# Altium schematic sheet tester.SchDoc
size A0
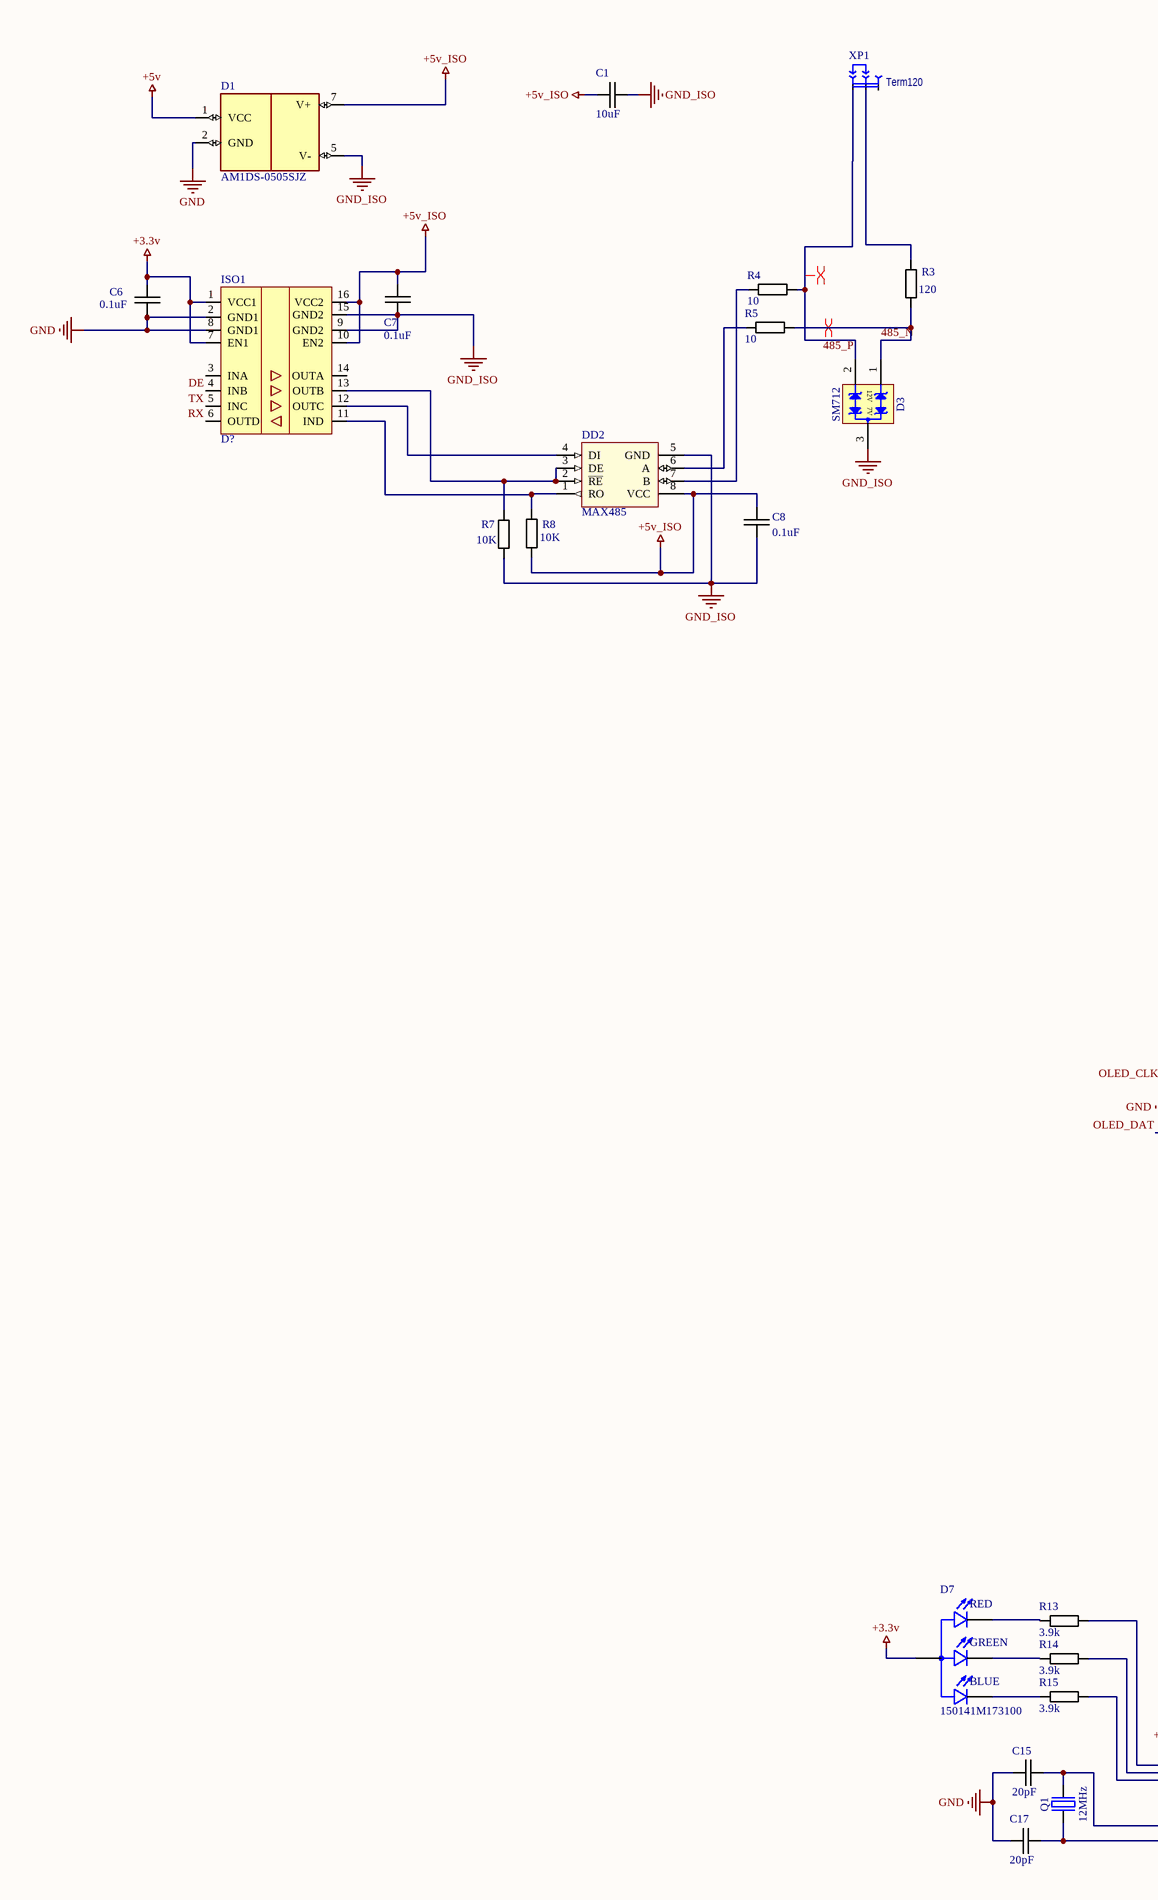
[diagram p0: tester.SchDoc, top left]
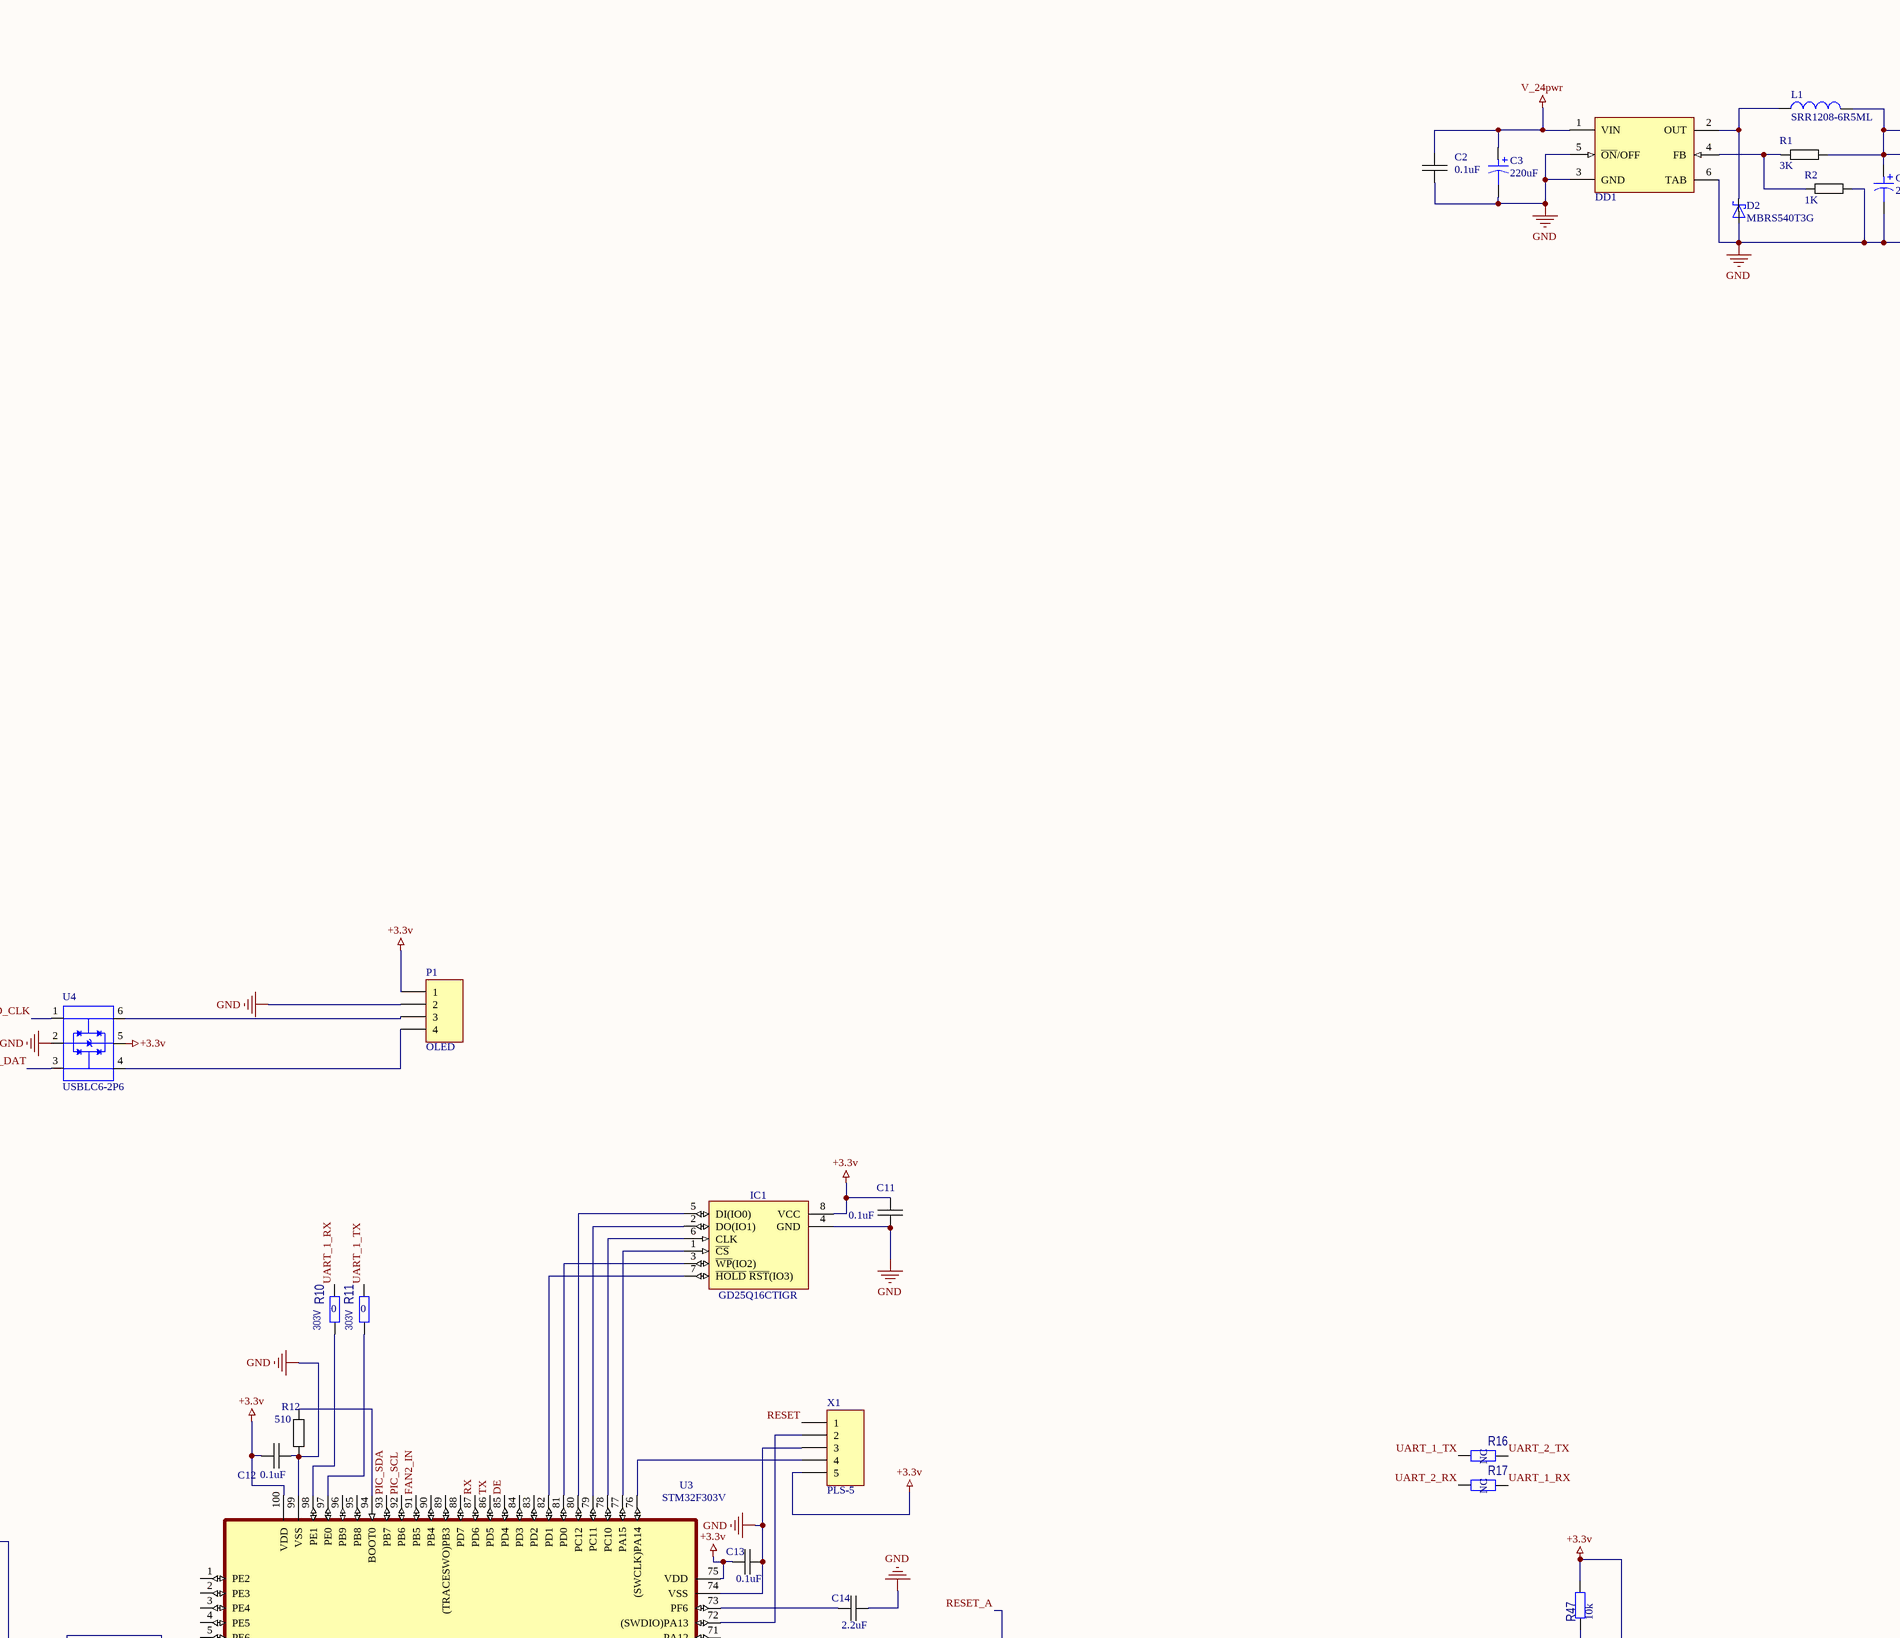
[diagram p1: tester.SchDoc, top middle]
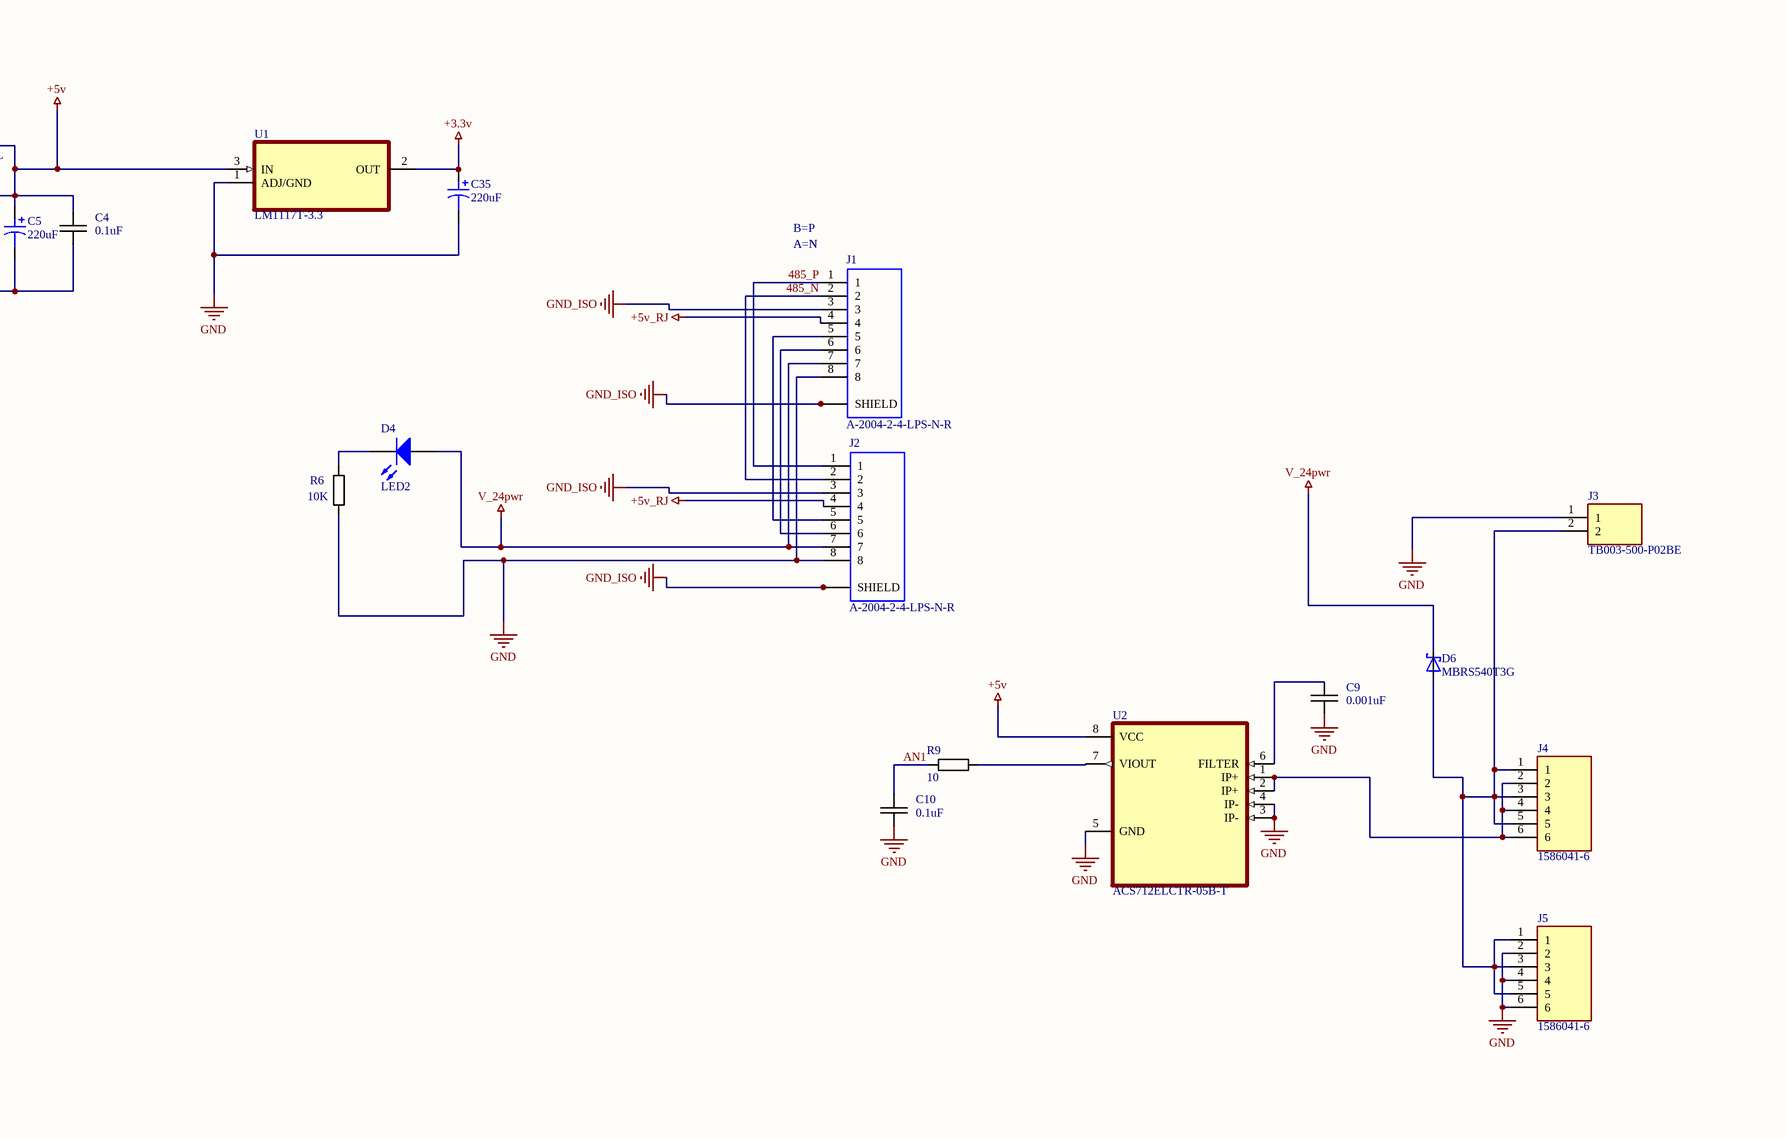
[diagram p2: tester.SchDoc, top right]
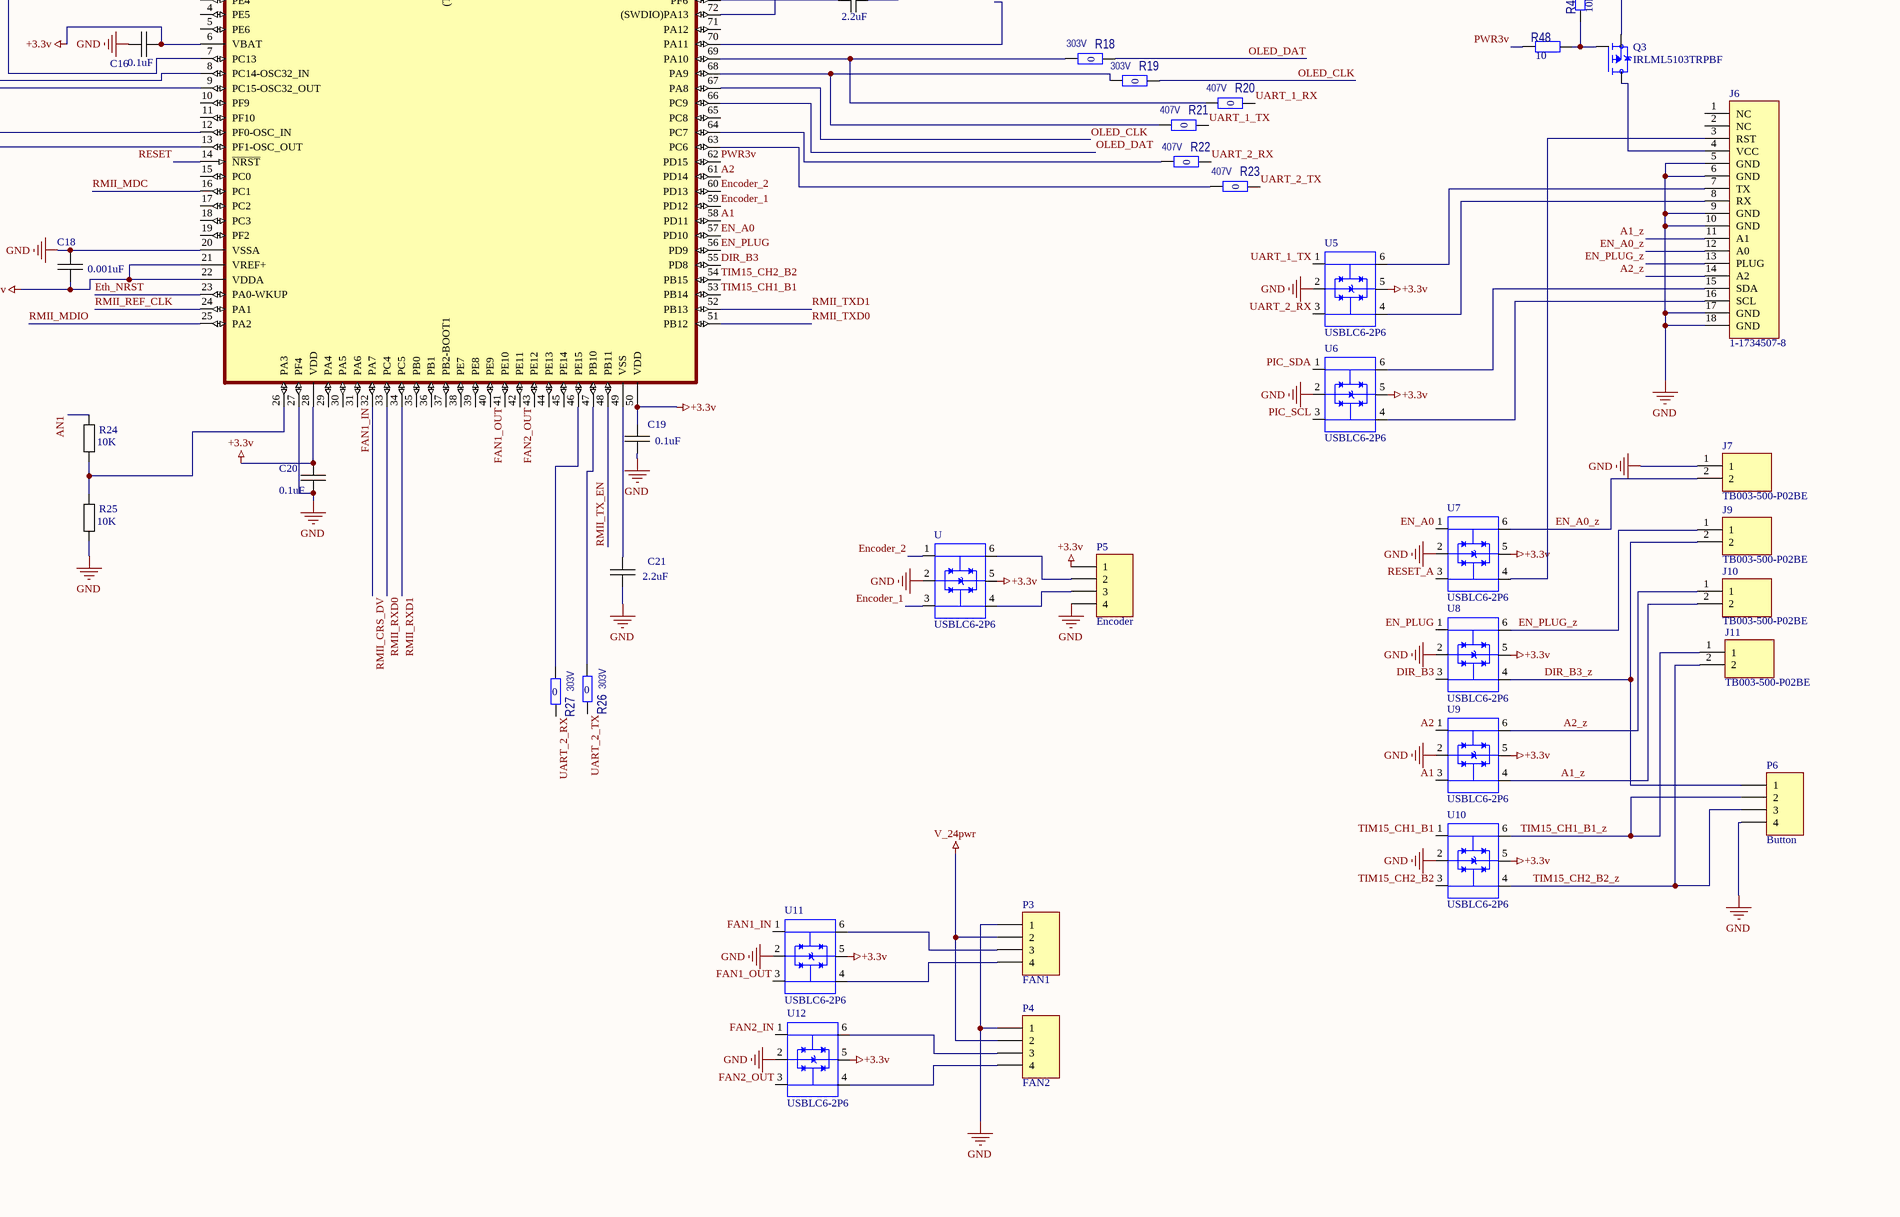
[diagram p3: tester.SchDoc, bottom middle]
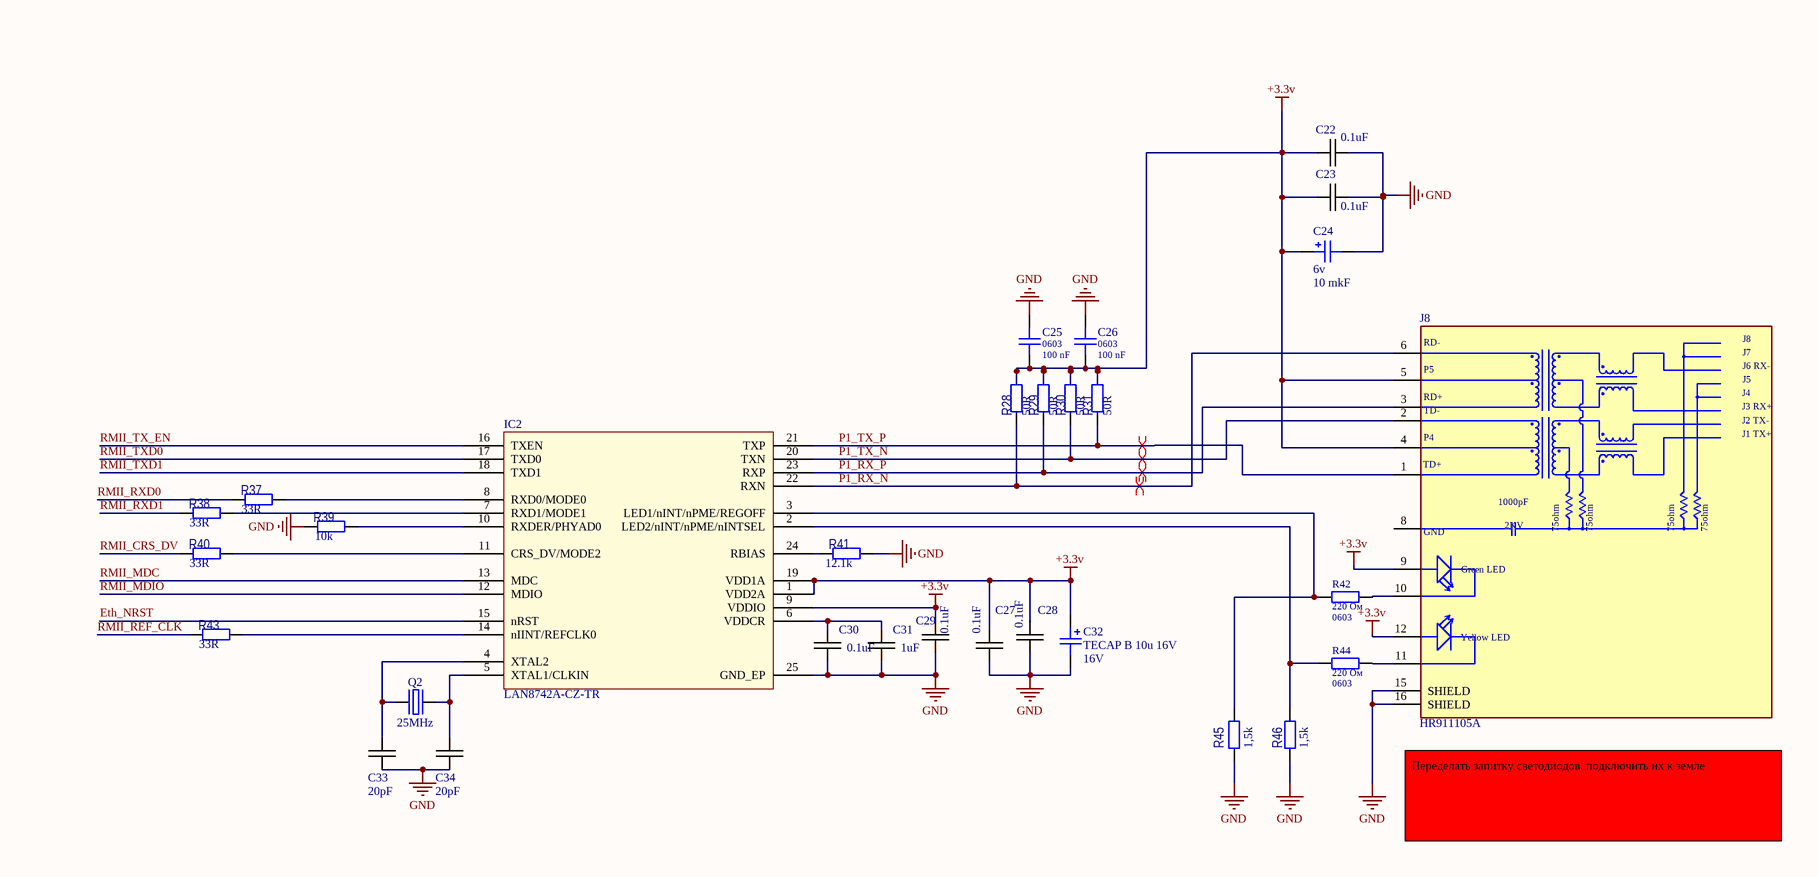
[diagram p4: tester.SchDoc, bottom right]

## Parts
C1  10uF  [CAPC3225X270N]
C2  0.1uF  [CAPACITOR 0603]
C3  value 220uF  [ECR 10x13mm]  (hidden comment: 220uF 50v)
C4  0.1uF  [CAPACITOR 0603]
C5  value 220uF  [ECR 10x13mm]  (hidden comment: 220uF 50v)
C6  0.1uF  [CAPACITOR 0603]
C7  0.1uF  [CAPACITOR 0603]
C8  0.1uF  [CAPACITOR 0603]
C9  0.001uF  [CAPACITOR 0603]
C10  0.1uF  [CAPACITOR 0603]
C11  0.1uF  [CAPACITOR 0603]
C12  0.1uF  [CAPACITOR 0603]
C13  0.1uF  [CAPACITOR 0603]
C14  2.2uF  [CAPACITOR 0805]
C15  20pF  [CAPACITOR 0603]
C16  0.1uF  [CAPACITOR 0603]
C17  20pF  [CAPACITOR 0603]
C18  0.001uF  [CAPACITOR 0603]
C19  0.1uF  [CAPACITOR 0603]
C20  0.1uF  [CAPACITOR 0603]
C21  2.2uF  [CAPACITOR 0805]
C22  0.1uF  [CAPACITOR 0603]
C23  0.1uF  [CAPACITOR 0603]
C24  value 10 mkF  Voltage: 6v  [TECAP B]  (hidden comment: Cap T)
C25  Type: 0603  [CAPCHIP0603]  (hidden comment: 100 nF)
C26  Type: 0603  [CAPCHIP0603]  (hidden comment: 100 nF)
C27  0.1uF  [CAPACITOR 0603]
C28  0.1uF  [CAPACITOR 0603]
C29  0.1uF  [CAPACITOR 0603]
C30  0.1uF  [CAPACITOR 0603]
C31  1uF  [CAPACITOR 0603]
C32  Voltage: 16V  [TECAP B]  (hidden comment: TECAP B 10u 16V)
C33  20pF  [CAPACITOR 0603]
C34  20pF  [CAPACITOR 0603]
C35  value 220uF  [ECR 10x13mm]  (hidden comment: 220uF 50v)
D1  AM1DS-0505SJZ  [AM2D-NZ]
D2  MBRS540T3G  [DIOM7958X213N]
D3  SM712  [SOT23]
D4  LED2  [3.2X1.6X1.1]
D6  MBRS540T3G  [DIOM7958X213N]
D7  150141M173100  [LED_150141M173100]
DD1  LM2596S-ADJ  [TO-263]  (value not drawn)
DD2  MAX485  [NSO8]
IC1  GD25Q16CTIGR  [NSO8]
IC2  LAN8742A-CZ-TR  [LAN8742A]
ISO1  D?  [*SOIC127P1030X265-16N]
J1  A-2004-2-4-LPS-N-R  [ASSMANN_A-2004-2-4-LPS-N-R]
J2  A-2004-2-4-LPS-N-R  [ASSMANN_A-2004-2-4-LPS-N-R]
J3  TB003-500-P02BE  [CUI_TB003-500-P02BE]
J4  1586041-6  [TE_1586041-6]
J5  1586041-6  [TE_1586041-6]
J6  1-1734507-8  [TE_1-1734507-8]
J7  TB003-500-P02BE  [CUI_TB003-500-P02BE]
J8  HR911105A  [HANRUN_HR911105A]
J9  TB003-500-P02BE  [CUI_TB003-500-P02BE]
J10  TB003-500-P02BE  [CUI_TB003-500-P02BE]
J11  TB003-500-P02BE  [CUI_TB003-500-P02BE]
L1  SRR1208-6R5ML  [SRR1208]
P1  OLED  [HDR1X4]
P3  FAN1  [HDR1X4]
P4  FAN2  [HDR1X4]
P5  Encoder  [HDR1X4]
P6  Button  [HDR1X4]
Q1  12MHz  [HC49SM]
Q2  25MHz  [HC49SM]
Q3  IRLML5103TRPBF  [SOT95P237X112-3N]
R1  3K  [Resistor 0603]
R2  1K  [Resistor 0603]
R3  120  [Resistor 0805]
R4  10  [Resistor 0805]
R5  10  [Resistor 0805]
R6  10K  [Resistor 0805]
R7  10K  [Resistor 0805]
R8  10K  [Resistor 0805]
R9  10  [Resistor 0805]
R10  0  [RESCHIP0603]
R11  0  [RESCHIP0603]
R12  510  [Resistor 0805]
R13  3.9k  [Resistor 0805]
R14  3.9k  [Resistor 0805]
R15  3.9k  [Resistor 0805]
R16  NC  [RESCHIP0603]
R17  NC  [RESCHIP0603]
R18  0  [RESCHIP0603]
R19  0  [RESCHIP0603]
R20  0  Class: 407V  [RESCHIP0603]
R21  0  Class: 407V  [RESCHIP0603]
R22  0  Class: 407V  [RESCHIP0603]
R23  0  Class: 407V  [RESCHIP0603]
R24  10K  [Resistor 0805]
R25  10K  [Resistor 0805]
R26  0  [RESCHIP0603]
R27  0  [RESCHIP0603]
R28  50R  [RESCHIP0603]
R29  50R  [RESCHIP0603]
R30  50R  [RESCHIP0603]
R31  50R  [RESCHIP0603]
R37  33R  [RESCHIP0603]
R38  33R  [RESCHIP0603]
R39  10k  [RESCHIP0603]
R40  33R  [RESCHIP0603]
R41  12.1k  [RESCHIP0603]
R42  Type: 0603  [RESCHIP0603]  (hidden comment: 220 Ом)
R43  33R  [RESCHIP0603]
R44  Type: 0603  [RESCHIP0603]  (hidden comment: 220 Ом)
R45  1,5k  [RESCHIP0603]
R46  1,5k  [RESCHIP0603]
R47  10k  [RESCHIP0805]
R48  10  [RESCHIP0805]
U  USBLC6-2P6  [SOT50P160X60-6N]
U1  LM1117T-3.3  [TO-220-KCS0003B]
U2  ACS712ELCTR-05B-T  [SOIC127P600X175-8N]
U3  STM32F303V  [QFP50P1600X1600X160-100N]
U4  USBLC6-2P6  [SOT50P160X60-6N]
U5  USBLC6-2P6  [SOT50P160X60-6N]
U6  USBLC6-2P6  [SOT50P160X60-6N]
U7  USBLC6-2P6  [SOT50P160X60-6N]
U8  USBLC6-2P6  [SOT50P160X60-6N]
U9  USBLC6-2P6  [SOT50P160X60-6N]
U10  USBLC6-2P6  [SOT50P160X60-6N]
U11  USBLC6-2P6  [SOT50P160X60-6N]
U12  USBLC6-2P6  [SOT50P160X60-6N]
X1  PLS-5  [PLS-5-3D]
XP1  Term120  [ZL201-3]

## Nets
3.3v: C18.2 U3.21(VREF+) U3.22(VDDA)
+3.3v: C6.1 C11.1 C12.1 C13.1 C16.2 C19.1 C20.1 C22.1 C23.1 C24.1 C25.1 C26.1 C27.1 C28.2 C29.1 C32.1 C35.1 D7.1(A) IC1.8(VCC) IC2.1(VDD2A) IC2.9(VDDIO) IC2.19(VDD1A) ISO1.1(VCC1) ISO1.7(EN1) J8.4(P4) J8.5(P5) J8.9(GA) J8.12(YA) P1.1 P5.1 Q3.2(S) R28.2 R29.2 R30.2 R31.2 R47.2 U.5(VBUS) U1.2(OUT) U3.6(VBAT) U3.28(VDD) U3.50(VDD) U3.75(VDD) U3.100(VDD) U4.5(VBUS) U5.5(VBUS) U6.5(VBUS) U7.5(VBUS) U8.5(VBUS) U9.5(VBUS) U10.5(VBUS) U11.5(VBUS) U12.5(VBUS) X1.5
+5v: C4.2 C5.1 D1.1(VCC) L1.P$2 R1.2 U1.3(IN) U2.8(VCC)
+5v_ISO: C1.2 C7.2 C8.2 D1.7(V+) DD2.8(VCC) ISO1.10(EN2) ISO1.16(VCC2) R8.1
+5v_RJ: J1.4 J2.4
GND: C2.1 C3.2 C4.1 C5.2 C6.2 C9.1 C10.1 C11.2 C12.2 C13.2 C14.2 C15.1 C16.1 C17.1 C18.1 C19.2 C20.2 C21.1 C22.2 C23.2 C24.2 C25.2 C26.2 C27.2 C28.1 C29.2 C30.2 C31.2 C32.2 C33.1 C34.1 C35.2 D1.2(GND) D2.A DD1.3(GND) DD1.5(~{ON}/OFF) DD1.6(TAB) IC1.4(GND) IC2.25(GND_EP) ISO1.2(GND1) ISO1.8(GND1) J1.8 J2.8 J3.1 J5.2 J5.4 J5.6 J6.5(GND) J6.6(GND) J6.9(GND) J6.10(GND) J6.17(GND) J6.18(GND) J7.1 J8.15(SHIELD) J8.16(SHIELD) P1.2 P3.1 P4.1 P5.4 P6.4 R2.2 R6.2 R12.2 R25.1 R39.1 R41.2 R45.1 R46.1 U.2(GND) U1.1(ADJ/GND) U2.3(IP-) U2.4(IP-) U2.5(GND) U3.20(VSSA) U3.27(PF4) U3.74(VSS) U3.99(VSS) U4.2(GND) U5.2(GND) U6.2(GND) U7.2(GND) U8.2(GND) U9.2(GND) U10.2(GND) U11.2(GND) U12.2(GND) X1.3
GND_ISO: C1.1 C7.1 C8.1 D1.5(V-) D3.3(GND) DD2.5(GND) ISO1.9(GND2) ISO1.15(GND2) J1.3 J1.S1(SHIELD) J1.S2(SHIELD) J2.3 J2.S1(SHIELD) J2.S2(SHIELD) R7.2
V_24pwr: C2.2 C3.1 D4.1(A) D6.C DD1.1(VIN) J1.7 J2.7 P3.2 P4.2
485_N: D3.1(I/O1) J1.2 J2.2 R3.2 R5.1
485_P: D3.2(I/O2) J1.1 J2.1 R4.1 XP1.1
A1: U3.58(PD11) U9.3(I/O2_1)
A1_z: J6.11(A1) J10.2 U9.4(I/O2_2)
A2: U3.61(PD14) U9.1(I/O1_1)
A2_z: J6.14(A2) J10.1 U9.6(I/O1_2)
AN1: C10.2 R9.2 R24.2
DE: ISO1.4(INB) U3.85(PD4)
DIR_B3: U3.55(PD8) U8.3(I/O2_1)
DIR_B3_z: J9.2 P6.1 U8.4(I/O2_2)
EN_A0: U3.57(PD10) U7.1(I/O1_1)
EN_A0_z: J6.12(A0) J7.2 U7.6(I/O1_2)
EN_PLUG: U3.56(PD9) U8.1(I/O1_1)
EN_PLUG_z: J6.13(PLUG) J9.1 U8.6(I/O1_2)
Encoder_1: U.3(I/O2_1) U3.59(PD12)
Encoder_2: U.1(I/O1_1) U3.60(PD13)
Eth_NRST: IC2.15(nRST) U3.23(PA0-WKUP)
FAN1_IN: U3.31(PA6) U11.1(I/O1_1)
FAN1_OUT: U3.40(PE9) U11.3(I/O2_1)
FAN2_IN: U3.91(PB5) U12.1(I/O1_1)
FAN2_OUT: U3.42(PE11) U12.3(I/O2_1)
OLED_CLK: R19.2 U3.67(PA8) U4.1(I/O1_1)
OLED_DAT: R18.2 U3.66(PC9) U4.3(I/O2_1)
P1_RX_N: IC2.22(RXN) J8.6(RD-) R28.1
P1_RX_P: IC2.23(RXP) J8.3(RD+) R29.1
P1_TX_N: IC2.20(TXN) J8.2(TD-) R30.1
P1_TX_P: IC2.21(TXP) J8.1(TD+) R31.1
PIC_SCL: U3.92(PB6) U6.3(I/O2_1)
PIC_SDA: U3.93(PB7) U6.1(I/O1_1)
PWR3v: R48.1 U3.62(PD15)
RESET: U3.14(~{NRST}) X1.1
RESET_A: U3.70(PA11) U7.3(I/O2_1)
RMII_CRS_DV: R40.1 U3.32(PA7)
RMII_MDC: IC2.13(MDC) U3.16(PC1)
RMII_MDIO: IC2.12(MDIO) U3.25(PA2)
RMII_REF_CLK: R43.1 U3.24(PA1)
RMII_RXD0: R37.1 U3.33(PC4)
RMII_RXD1: R38.1 U3.34(PC5)
RMII_TX_EN: IC2.16(TXEN) U3.48(PB11)
RMII_TXD0: IC2.17(TXD0) U3.51(PB12)
RMII_TXD1: IC2.18(TXD1) U3.52(PB13)
RX: ISO1.6(OUTD) U3.87(PD6)
TIM15_CH1_B1: U3.53(PB14) U10.1(I/O1_1)
TIM15_CH1_B1_z: J11.1 P6.2 U10.6(I/O1_2)
TIM15_CH2_B2: U3.54(PB15) U10.3(I/O2_1)
TIM15_CH2_B2_z: J11.2 P6.3 U10.4(I/O2_2)
TX: ISO1.5(INC) U3.86(PD5)
UART_1_RX: R10.2 R17.2 R20.2
UART_1_TX: R11.2 R16.1 R21.2 U5.1(I/O1_1)
UART_2_RX: R17.1 R22.2 R27.2 U5.3(I/O2_1)
UART_2_TX: R16.2 R23.2 R26.2
NetC9_2: C9.2 U2.6(FILTER)
NetC14_1: C14.1 U3.73(PF6)
NetC15_2: C15.2 Q1.2(OSC2) U3.12(PF0-OSC_IN)
NetC17_2: C17.2 Q1.1(OSC1) U3.13(PF1-OSC_OUT)
NetC21_2: C21.2 U3.49(VSS)
NetC30_1: C30.1 C31.1 IC2.6(VDDCR)
NetC33_2: C33.2 IC2.4(XTAL2) Q2.1(OSC1)
NetC34_2: C34.2 IC2.5(XTAL1/CLKIN) Q2.2(OSC2)
NetD2_C: D2.C DD1.2(OUT) L1.P$1
NetD4_2: D4.2(K) R6.1
NetD6_A: D6.A J3.2 J4.1 J4.3 J4.5 J5.1 J5.3 J5.5
NetD7_2: D7.2(B_C) R15.2
NetD7_3: D7.3(R_C) R13.2
NetD7_4: D7.4(G_C) R14.2
NetDD1_4: DD1.4(FB) R1.1 R2.1
NetDD2_1: DD2.1(RO) ISO1.11(IND) R8.2
NetDD2_2: DD2.2(~{RE}) DD2.3(DE) ISO1.13(OUTB) R7.1
NetDD2_4: DD2.4(DI) ISO1.12(OUTC)
NetDD2_6: DD2.6(A) R5.2
NetDD2_7: DD2.7(B) R4.2
NetIC1_1: IC1.1(~{CS}) U3.77(PA15)
NetIC1_2: IC1.2(DO(IO1)) U3.79(PC11)
NetIC1_3: IC1.3(~{WP}(IO2)) U3.81(PD0)
NetIC1_5: IC1.5(DI(IO0)) U3.80(PC12)
NetIC1_6: IC1.6(CLK) U3.78(PC10)
NetIC1_7: IC1.7(~{HOLD}_~{RST}(IO3)) U3.82(PD1)
NetIC2_2: IC2.2(LED2/nINT/nPME/nINTSEL) R44.1 R46.2
NetIC2_3: IC2.3(LED1/nINT/nPME/REGOFF) R42.1 R45.2
NetIC2_7: IC2.7(RXD1/MODE1) R38.2
NetIC2_8: IC2.8(RXD0/MODE0) R37.2
NetIC2_10: IC2.10(RXDER/PHYAD0) R39.2
NetIC2_11: IC2.11(CRS_DV/MODE2) R40.2
NetIC2_14: IC2.14(nIINT/REFCLK0) R43.2
NetIC2_24: IC2.24(RBIAS) R41.1
NetJ1_5: J1.5 J2.5
NetJ1_6: J1.6 J2.6
NetJ4_2: J4.2 J4.4 J4.6 U2.1(IP+) U2.2(IP+)
NetJ6_3: J6.3(RST) U7.4(I/O2_2)
NetJ6_4: J6.4(VCC) Q3.3(D)
NetJ6_7: J6.7(TX) U5.6(I/O1_2)
NetJ6_8: J6.8(RX) U5.4(I/O2_2)
NetJ6_15: J6.15(SDA) U6.6(I/O1_2)
NetJ6_16: J6.16(SCL) U6.4(I/O2_2)
NetJ8_10: J8.10(GC) R42.2
NetJ8_11: J8.11(YC) R44.2
NetP1_3: P1.3 U4.6(I/O1_2)
NetP1_4: P1.4 U4.4(I/O2_2)
NetP3_3: P3.3 U11.6(I/O1_2)
NetP3_4: P3.4 U11.4(I/O2_2)
NetP4_3: P4.3 U12.6(I/O1_2)
NetP4_4: P4.4 U12.4(I/O2_2)
NetP5_2: P5.2 U.6(I/O1_2)
NetP5_3: P5.3 U.4(I/O2_2)
NetQ3_1: Q3.1(G) R47.1 R48.2
NetR3_1: R3.1 XP1.2
NetR9_1: R9.1 U2.7(VIOUT)
NetR10_1: R10.1 U3.98(PE1)
NetR11_1: R11.1 U3.97(PE0)
NetR12_1: R12.1 U3.94(BOOT0)
NetR13_1: R13.1 U3.7(PC13)
NetR14_1: R14.1 U3.8(PC14-OSC32_IN)
NetR15_1: R15.1 U3.9(PC15-OSC32_OUT)
NetR18_1: R18.1 R20.1 U3.69(PA10)
NetR19_1: R19.1 R21.1 U3.68(PA9)
NetR22_1: R22.1 U3.64(PC7)
NetR23_1: R23.1 U3.63(PC6)
NetR24_1: R24.1 R25.2 U3.26(PA3)
NetR26_1: R26.1 U3.47(PB10)
NetR27_1: R27.1 U3.46(PE15)
NetU3_72: U3.72((SWDIO)PA13) X1.2
NetU3_76: U3.76((SWCLK)PA14) X1.4

Not connected (* = marked no-connect by the designer): ISO1 3(INA) 14(OUTA); J6 1(NC) 2(NC); J8 8(GND); U3 1(PE2) 2(PE3) 3(PE4) 4(PE5) 5(PE6) 10(PF9) 11(PF10) 15(PC0) 17(PC2) 18(PC3) 19(PF2) 29(PA4) 30(PA5) 35(PB0) 36(PB1) 37(PB2-BOOT1) 38(PE7) 39(PE8) 41(PE10) 43(PE12) 44(PE13) 45(PE14) 65(PC8) 71(PA12) 83(PD2) 84(PD3) 88(PD7) 89((TRACESWO)PB3) 90(PB4) 95(PB8) 96(PB9); XP1 3

## Layout directives
differential pair: 485_N, 485_P, P1_RX_N, P1_RX_P, P1_TX_N, P1_TX_P

## Notes on the sheet
- B=P
- (near J1) A=N
- (near J8) Переделать запитку светодиодов. подключить их к земле
- (in symbol 150141M173100) RED; GREEN; BLUE
- (in symbol HR911105A) J7; J6 RX-; J5; J4; J3 RX+; J2 TX-; J1 TX+; 1000pF; 2KV; 75ohm; Green LED; Yellow LED
- (in symbol SM712) 12V; 7V

## Library data of the parts
C1 C2 C4 C6-C23 C27-C31 C33 C34 = Capasitor: Value: *
C3 C5 C35 = Cap Pol: Polarized Capacitor (Rad); Voltage: 50; Type: Type; URL: http://www.hitano.com.tw/PDF/ECR_081225.pdf
C24 C32 = Cap T: Solid Tantalum Surface Mount Capacitors
  C24: Type: Type
  C32: Value: TECAP B 10u 16V; Type: TECAP B
C25 C26 = Cap C: Керамическтй конденсатор SMD C0603; Value: 100 nF
D2 D6 = MBRS540T3G: Diode Schottky 40V 5A Surface Mount SMC; MF: ON Semiconductor; SnapEDA_Link: https://www.snapeda.com/parts/MBRS540T3G/ON%20Semiconductor/view-part/78777/?ref=snap; MP: MBRS540T3G; Availability: Unavailable; Price: None; Value: *; Package: DO-214 ON Semiconductor
D3 = SM712: Asymmetrical TVS Diode for Extended Common-Mode RS-485
D4 = LED2: Typical RED, GREEN, YELLOW, AMBER GaAs LED; Published: 8-Jun-2000; LatestRevisionDate: 17-Jul-2002; LatestRevisionNote: Re-released for DXP Platform.; PackageVersion: Feb-2002; PackageReference: 3.2X1.6X1.1; Publisher: Altium Limited; PackageDescription: SM LED; 2 Flat Leads
D7 = 150141M173100: Red, Green, Blue _RGB_ 625nm Red, 520nm Green, 470nm Blue LED Indication - Discrete 2V Red, 3.2V Green, 3.2V Blue 1411 _3528 Metric_; MF: Wurth Electronics; SnapEDA_Link: https://www.snapeda.com/parts/150141M173100/Wurth%20Electronics%20Inc./view-part/281733/?ref=snap; Price: None; MP: 150141M173100; Package: 1411 WÃ¼rth Elektronik; Value: *; Availability: Unavailable
DD1 = LM2596S-ADJ: SIMPLE SWITCHER® Power Converter 150 KHz 3A Step-Down Voltage Regulator, 5-pin TO-263; Manufacturer: National Semiconductor; Published: 13.04.2012; Publisher: Reukov A.V.; PartNumber: LM2596S-ADJ; CompType: Switcher; ComponentLink1URL: http://www.national.com/ds/LM/LM2596.pdf; ComponentLink2URL: http://www.national.com/pf/LM/LM2596.html; ComponentLink3URL: http://www.national.com/packaging/folders/ts5b.html
DD2 = MAX485: Low-Power, Slew-Rate-Limited RS-485/RS-422 Transceiver; ComponentLink1URL: http://pdfserv.maxim-ic.com/en/ds/MAX1487-MAX491.pdf; Type: MAX485
IC1 = W25Q128FVEIG: 128M-bit Serial Flash Memory with uniform 4KB sectors and Dual/Quad SPI and QPI
ISO1 = ISO7341
J1 J2 = A-2004-2-4-LPS-N-R: Jack Modular Connector 8p8c _RJ45, Ethernet_ 90Â° Angle _Right_ Shielded; MF: Assmann WSW; Package: None; MP: A-2004-2-4-LPS-N-R; Value: *; Price: None; Availability: Unavailable; SnapEDA_Link: https://www.snapeda.com/parts/A-2004-2-4-LPS-N-R/Assmann%20WSW%20Components/view-part/454861/?ref=snap
J3 J7 J9-J11 = TB003-500-P02BE: 2~24 Poles, Screw Type, Horizontal, 5.0 Pitch, 26~14 _AWG_, Terminal Block Connector; MF: CUI Devices; MP: TB003-500-P02BE; Availability: Unavailable; Package: None; SnapEDA_Link: https://www.snapeda.com/parts/TB003-500-P02BE/CUI%20Devices/view-part/3590637/?ref=snap; Price: None; Value: *
J8 = HR911105A: HR911105A Ethernet Interface Arduino Platform Evaluation Expansion Board; MF: DFRobot; Package: None; Availability: Unavailable; MP: HR911105A; Value: *; SnapEDA_Link: https://www.snapeda.com/parts/HR911105A/DFRobot/view-part/214807/?ref=snap; Price: None
L1 = SRR1208-6R5ML: 6.5ÂµH Shielded Wirewound Inductor 6A 18mOhm Max Nonstandard; MF: Bourns; Availability: Unavailable; SnapEDA_Link: https://www.snapeda.com/parts/SRR1208-6R5ML/Bourns/view-part/353452/?ref=snap; Value: *; Package: Nonstandard Bourns; MP: SRR1208-6R5ML; Price: None
P1 P3-P6 = Header 4: Header, 4-Pin; LatestRevisionDate: 17-Jul-2002; LatestRevisionNote: Re-released for DXP Platform.; Publisher: Altium Limited
Q1 Q2 = Quartz Crystal
Q3 = IRLML5103TRPBF: RoHS Compliant | Low RDS(on) | Industry-leading quality | Dynamic dv/dt Rating | Fast Switching | Fully Avalanche Rated | 175C Operating Temperature | P-Channel MOSFET; Package: None; Price: None; Value: *; MP: IRLML5103TRPBF; Availability: Unavailable
R1-R9 R12-R15 R24 R25 = Resistor: Value: *
R10 R11 R16-R23 R26 R27 = Res: 303V; Tolerance_Percent: {Tolerance_Percent}; SubClass: Резисторы; Power_W: {Power_W}; Installation: {Installation}; Ordering_Information: {Ordering_Information}; Body: {Body}; Pins: 2
  R10 R11 R18 R19 R26 R27: Value: 0; Class: 303V
  R16 R17: Value: NC
  R20-R23: Value: 0
R28-R31 R37-R41 R43 R45-R48 = Res: Резистор; Tolerance_Percent: {Tolerance_Percent}; Class: Электронные компоненты; SubClass: Резисторы; Power_W: {Power_W}; Installation: {Installation}; Ordering_Information: {Ordering_Information}; Body: {Body}; Pins: 2
  R28-R31: Value: 50R
  R37 R38 R40 R43: Value: 33R
  R39 R47: Value: 10k
  R41: Value: 12.1k
  R45 R46: Value: 1,5k
  R48: Value: 10
R42 R44 = Res: Резистор SMD R0603; Tolerance: %; PWR: Value; Value: 220 Ом
U U4-U12 = USBLC6-2P6: 17V Clamp 5A _8/20Âµs_ Ipp Tvs Diode Surface Mount SOT-666; MF: STMicroelectronics; Value: *; MP: USBLC6-2P6; SnapEDA_Link: https://www.snapeda.com/parts/USBLC6-2P6/STMicroelectronics/view-part/106846/?ref=snap; Availability: Unavailable; Price: None; Package: SOT-563 STMicroelectronics
U1 = LM1117T-3.3: Linear Voltage Regulator IC 1 Output 800mA TO-220-3; MF: Texas Instruments; MP: LM1117T-3.3; Price: None; Availability: Unavailable; Package: TO-220 Texas Instruments; SnapEDA_Link: https://www.snapeda.com/parts/LM1117T-3.3/Texas%20Instruments/view-part/103788/?ref=snap; Value: *
U2 = ACS712ELCTR-05B-T: Current Sensor 5A 1 Channel Hall Effect, Open Loop Bidirectional 8-SOIC _0.154, 3.90mm Width_; MF: Allegro MicroSystems LLC; MP: ACS712ELCTR-05B-T; Digi-Key_Part_Number: 620-1189-1-ND; Package: SOIC-8 Allegro MicroSystems LLC; Digi-Key_Purchase_URL: https://www.digikey.in/product-detail/en/allegro-microsystems/ACS712ELCTR-05B-T/620-1189-1-ND/1284606?utm_source=snapeda&utm_medium=aggregator&utm_campaign=symbol; Value: *; SnapEDA_Link: https://www.snapeda.com/parts/ACS712ELCTR-05B-T/Allegro%20MicroSystems%20LLC/view-part/46765/?ref=snap
U3 = STM32F303V: ARMÂ® CortexÂ®-M4 STM32F3 Microcontroller IC 32-Bit 72MHz 100-LQFP (14x14); MF: STMicroelectronics; Price: None; Value: *; Availability: Unavailable; Package: LQFP-100 STMicroelectronics; MP: STM32F303V
X1 = PLS-5: Header, 5-Pin; LatestRevisionDate: 17-Jul-2002; LatestRevisionNote: Re-released for DXP Platform.; Publisher: Altium Limited
XP1 = Select jump: Ter120; Class: Электронные компоненты; SubClass: Разъемы; Pitch_mm: {Pitch_mm}; Installation: DIP; Ordering_Information: {Ordering_Information}; Type_of_connector: {Type_of_connector}; Pins: 3; Value: Term120
J4 J5 = 1586041-6: Package: None; Price: None; Value: *; MP: 1586041-6; Availability: Unavailable
J6 = 1-1734507-8: Package: None; Price: None; Value: *; MP: 1-1734507-8; Availability: Unavailable